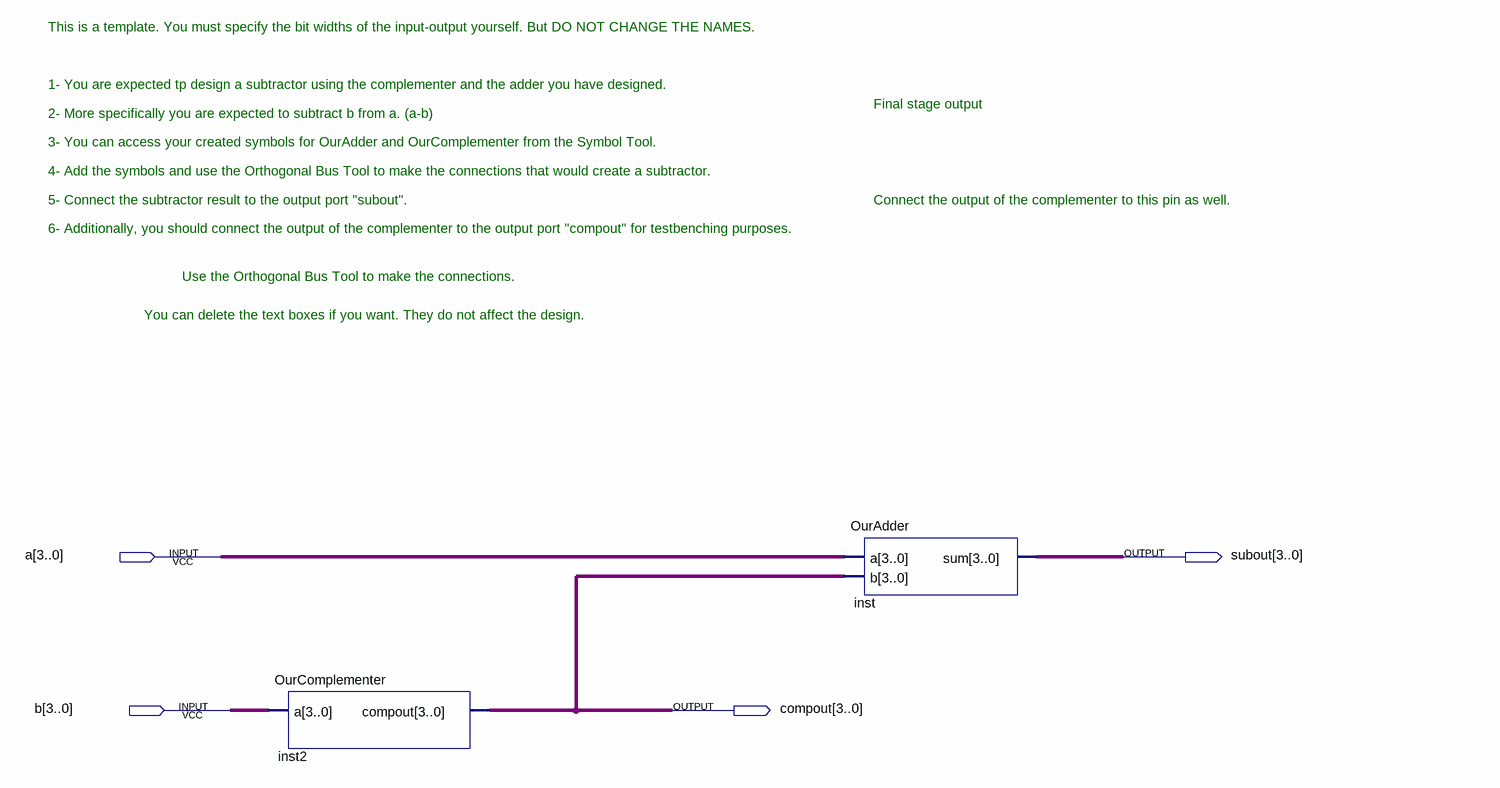
[diagram p0: schematic sheet]
// Quartus schematic OurSubtractorVerilog.bdf as structural Verilog: 2 symbols, 4 pins
module OurSubtractorVerilog (
  input  [3:0] a,
  input  [3:0] b,
  output [3:0] subout,
  output [3:0] compout
);

  OurComplementer inst2 (.a(b), .compout(compout));
  OurAdder inst (.a(a), .b(compout), .sum(subout));

  // Notes on the sheet:
  //   This is a template. You must specify the bit widths of the input-output yourself. But DO NOT CHANGE THE NAMES. 
  //   1- You are expected tp design a subtractor using the complementer and the adder you have designed.
  //   Final stage output
  //   2- More specifically you are expected to subtract b from a. (a-b)
  //   3- You can access your created symbols for OurAdder and OurComplementer from the Symbol Tool.
  //   4- Add the symbols and use the Orthogonal Bus Tool to make the connections that would create a subtractor.
  //   5- Connect the subtractor result to the output port "subout".
  //   Connect the output of the complementer to this pin as well.
  //   6- Additionally, you should connect the output of the complementer to the output port "compout" for testbenching purposes.
  //   Use the Orthogonal Bus Tool to make the connections.
  //   You can delete the text boxes if you want. They do not affect the design.
endmodule
